# EAGLE design AX12hat (EAGLE 7.4.0)
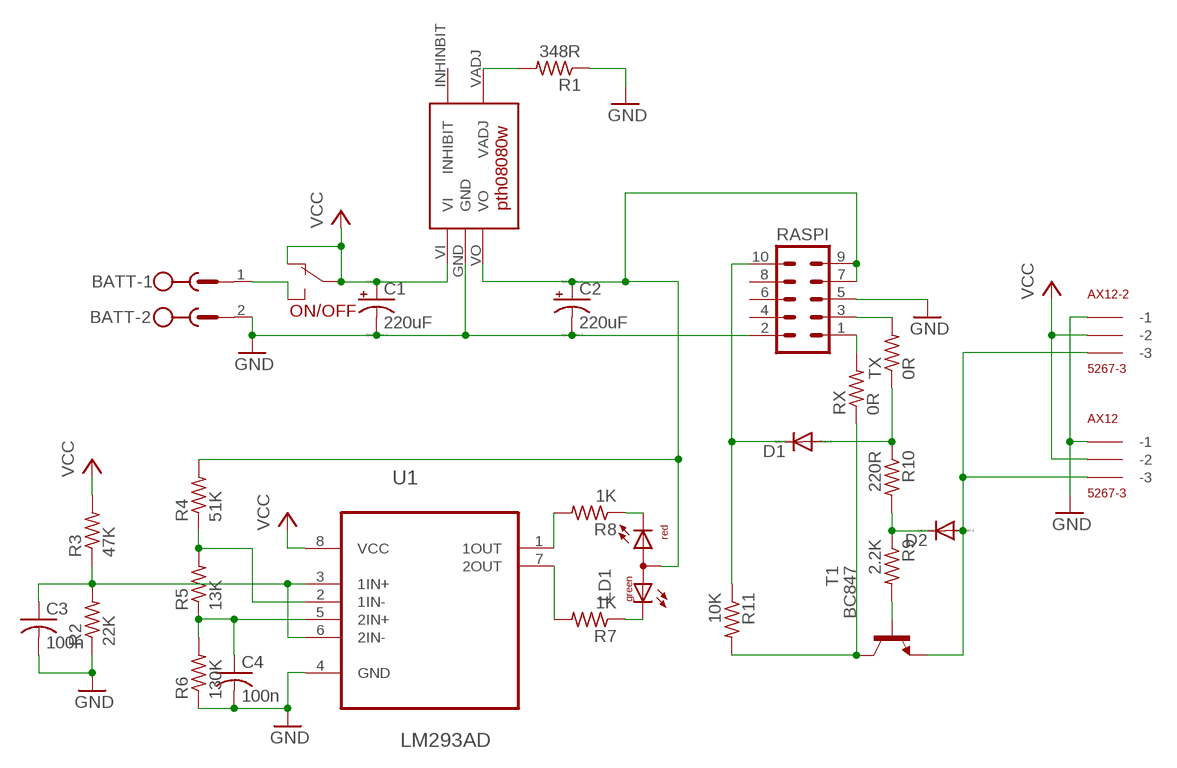
[diagram p0: schematic, sheet 1]

## Parts
AX12  5267-3  [5267-3]
AX12-2  5267-3  [5267-3]
BATT  MSTBV2  [MSTBV2]
C1  220uF  CPOL-USE2.5-7  [E2,5-7]
C2  220uF  CPOL-USE2.5-7  [E2,5-7]
C3  100n  C-USC0805  [C0805]
C4  100n  C-USC0805  [C0805]
D1  DIODE-SOD523  [SOD523]
D2  DIODE-SOD523  [SOD523]
LD1  DUOLED-RG-A  [DUOLED-A-5MM]
ON/OFF  SWITCH  [SWITCH]
R1  348R  R-US_R0805  [R0805]
R2  22K  R-US_R0805  [R0805]
R3  47K  R-US_R0805  [R0805]
R4  51K  R-US_R0805  [R0805]
R5  13K  R-US_R0805  [R0805]
R6  130K  R-US_R0805  [R0805]
R7  1K  R-US_R0805  [R0805]
R8  1K  R-US_R0805  [R0805]
R9  2.2K  R-US_R0805  [R0805]
R10  220R  R-US_R0805  [R0805]
R11  10K  R-US_R0805  [R0805]
RASPI  MA05-2  [MA05-2]
RX  0R  R-US_R0805  [R0805]
T1  BC847  [SOT23]
TX  0R  R-US_R0805  [R0805]
U1  LM293AD  [SOIC127P600X175-8N]
U$1  REGUL_PTH  [REGUL_PTH]

## Nets
GND: AX12-2.P$1(-1) AX12.P$1(-1) BATT.2 C1.- C2.- C3.2 C4.2 R1.1 R2.1 R6.1 RASPI.2 RASPI.5 U1.4(GND) U$1.GND
N$1: C2.+ LD1.A R4.2 RASPI.7 RASPI.9 U$1.VO
N$2: R1.2 U$1.VADJ
N$3: R8.2 U1.1(1OUT)
N$4: LD1.CR R8.1
N$5: R7.2 U1.7(2OUT)
N$6: LD1.CX(CG) R7.1
N$7: D2.C R9.1 R10.2
N$8: AX12-2.P$3(-3) AX12.P$3(-3) D2.A T1.2(E)
N$9: C3.1 R2.2 R3.1 U1.3(1IN+) U1.6(2IN-)
N$10: R4.1 R5.2 U1.2(1IN-)
N$11: C4.1 R5.1 R6.2 U1.5(2IN+)
N$12: R9.2 T1.1(B)
N$13: D1.C R11.1 RASPI.10
N$14: RASPI.1 RX.2
N$15: RASPI.3 TX.2
N$16: D1.A R10.1 TX.1
N$17: R11.2 RX.1 T1.3(C)
N$18: BATT.1 ON/OFF.P$3
VCC: AX12-2.P$2(-2) AX12.P$2(-2) C1.+ ON/OFF.P$1 ON/OFF.P$2 R3.2 U1.8(VCC) U$1.VI
Unconnected: RASPI.4 RASPI.6 RASPI.8 U$1.INHINBIT(INHIBIT)

## Library data of the parts
AX12 AX12-2 = con-molex-spox:5267-3
BATT = con-phoenix-500:MSTBV2: PHOENIX; OC_FARNELL: unknown; OC_NEWARK: unknown
C1 C2 = resistor:CPOL-US: POLARIZED CAPACITOR, American symbol
C3 C4 = resistor:C-US: CAPACITOR, American symbol
D1 D2 = diode:DIODE-: DIODE
LD1 = led:DUOLED-RG-A: DUO LED 2 colors (red/green), 5 mm, round, common Anode www.ligitek.com or other producers.
ON/OFF = switch:SWITCH
R1-R11 RX TX = resistor:R-US_: RESISTOR, American symbol
RASPI = con-lstb:MA05-2: PIN HEADER; OC_FARNELL: unknown; OC_NEWARK: unknown
T1 = transistor:BC847: NPN TRANSISTOR
U1 = LM293ADR:LM293AD: DUAL DIFFERENTIAL COMPARATORS; MPN: LM293AD; OC_FARNELL: 8389225; OC_NEWARK: 38K3696; PACKAGE: SOIC-8; SUPPLIER: TI
U$1 = regul_pth:REGUL_PTH: "adjustable voltage regulator pth08080w"

## Board
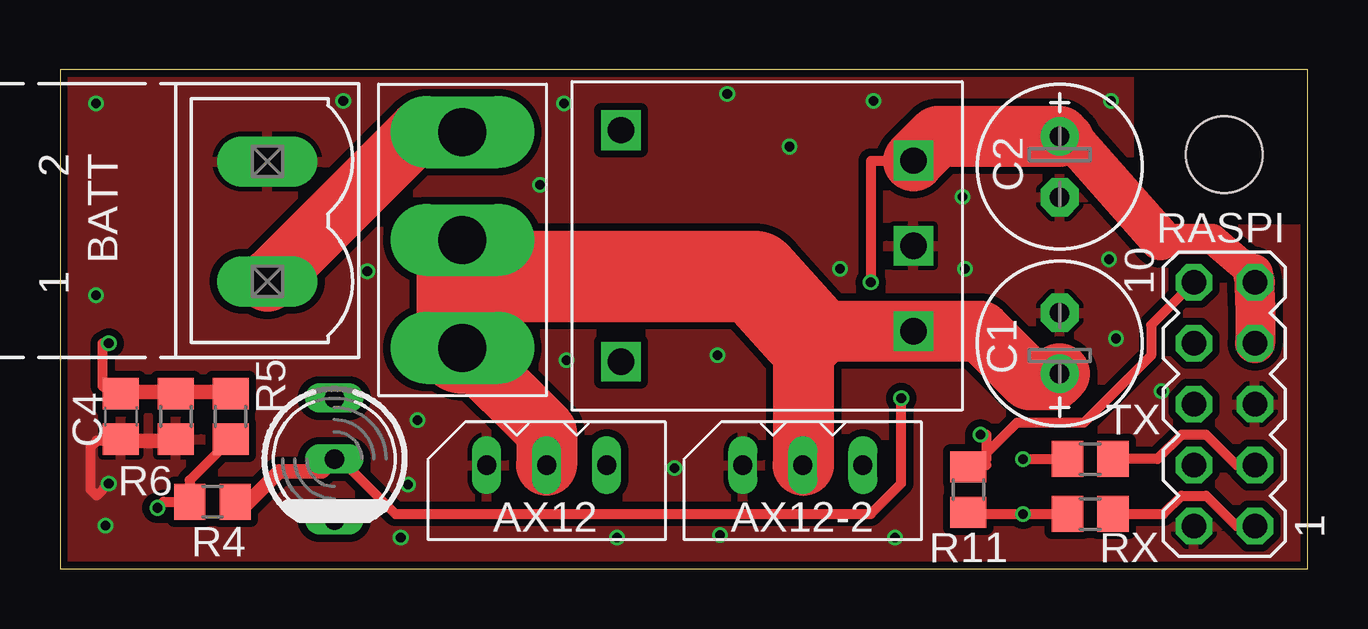
[diagram p1: board, top side]
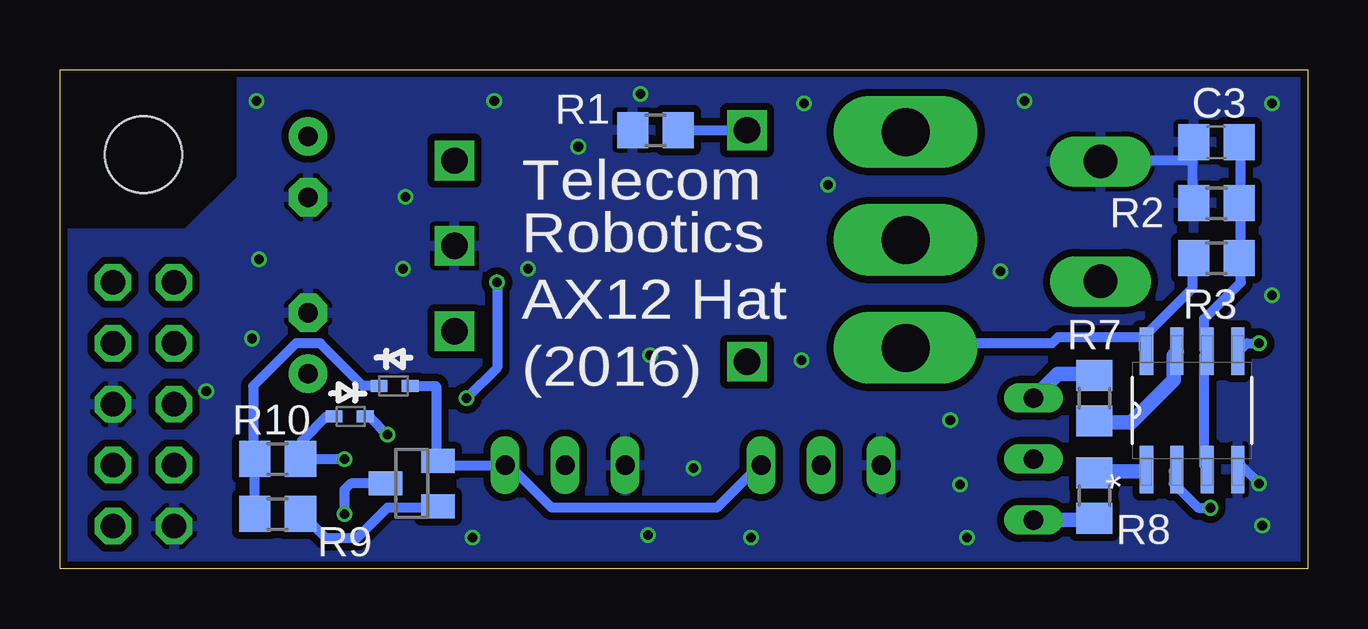
[diagram p2: board, bottom side, seen from below]

Size 51.99 x 20.82 mm. Coordinates in mm from the lower left corner, seen from the top.
Outline: 0,0 51.99,0 51.99,20.82 0,20.82 0,0
Copper layers (1*16): Top 0.018mm / dielectric 1.55mm / Bottom 0.018mm
Design rules "eurocircuit": minimum track width 0.15mm, minimum drill 0.35mm, track to track 0.15mm, track to pad 0.15mm, pad to pad 0.15mm, via to via 0.15mm, smd to smd 0mil, copper to edge 0.25mm, drill to drill 0.35mm, minimum pad ring 0.175mm, minimum via ring 0.125mm, stop-mask expansion 0mil, vias tented up to drill 0.45mm, thermal gap 0.2mm
Holes 3.2 mm at 48.51,17.27

### Footprints (pad centres in the part's own frame; a part is rotated, then mirrored left to right if it is on the bottom)
5267-3 = drill 0.8 long: P$1 0,0; P$2 2.5,0; P$3 5,0
MSTBV2 = drill 1.397 long: 1 -2.5,0; 2 2.5,0
E2,5-7 = drill 0.813 pad 1.6: + -1.27,0 | drill 0.813 pad 1.6 octagon: - 1.27,0
C0805 = smd 1.3 x 1.5: 1 -0.95,0; 2 0.95,0
SOD523 = smd 0.7 x 0.5: A 0.7,0; C -0.6,0
DUOLED-A-5MM = drill 0.813 long: A 0,0; CR 2.54,0; CX -2.54,0
SWITCH = drill 2 long: P$1 4.5,0; P$2 0,0; P$3 -4.5,0
R0805 = smd 1.3 x 1.5: 1 -0.95,0; 2 0.95,0
MA05-2 = drill 1.016 octagon: 1 -5.08,-1.27; 2 -5.08,1.27; 3 -2.54,-1.27; 4 -2.54,1.27; 5 0,-1.27; 6 0,1.27; 7 2.54,-1.27; 8 2.54,1.27; 9 5.08,-1.27; 10 5.08,1.27
SOT23 = smd 1 x 1.4: 1 -0.95,-1.1; 2 0.95,-1.1; 3 0,1.1
SOIC127P600X175-8N = smd 1.981 x 0.559: 1 -2.464,1.905; 2 -2.464,0.635; 3 -2.464,-0.635; 4 -2.464,-1.905; 5 2.464,-1.905; 6 2.464,-0.635; 7 2.464,0.635; 8 2.464,1.905
REGUL_PTH = drill 1.1 square: GND -6.096,1.27; INHINBIT 6.096,6.096; VADJ 6.096,-3.556; VI -6.096,4.826; VO -6.096,-2.286

### Placement (x,y rotation side)
AX12  17.78,4.32 0 top
AX12-2  28.45,4.32 0 top
BATT  8.64,14.48 90 top
C1  41.66,9.4 90 top
C2  41.66,16.76 270 top
C3  3.81,17.78 180 bottom
C4  2.54,6.35 270 top
D1  39.88,6.35 180 bottom
D2  38.1,7.62 0 bottom
LD1  11.43,4.57 270 top
ON/OFF  16.76,13.72 270 top
R1  27.18,18.29 0 bottom
R2  3.81,15.24 0 bottom
R3  3.81,12.95 180 bottom
R4  6.35,2.79 0 top
R5  7.11,6.35 270 top
R6  4.83,6.35 90 top
R7  8.89,7.11 270 bottom
R8  8.89,3.05 90 bottom
R9  42.93,2.29 0 bottom
R10  42.93,4.57 180 bottom
R11  37.85,3.3 270 top
RASPI  48.51,6.86 90 top
RX  42.93,2.29 0 top
T1  37.34,3.56 90 bottom
TX  42.93,4.57 0 top
U1  4.83,6.6 90 bottom
U$1  29.46,14.73 180 top

### Tracks (layer width: path | path; a pad name or v marks a point on that pad's centre or on a via)
GND  (via drill 0.4)
  Top 0.406: C4.2 2.29,5.33 1.52,5.33 1.27,5.08 1.27,3.3 1.52,3.05 v2.03,3.56
  Top 0.61: R6.1 4.83,5.33 2.54,5.33 C4.2
  Bottom 0.406: 4.83,17.02 4.83,17.78 C3.2 | 4.83,17.02 4.83,15.24 R2.1 | 4.83,17.02 8.64,17.02 BATT.2 | v2.03,3.56 2.79,4.32 U1.4
  other vias: 1.9,1.8 1.5,11.4 12.8,12.4 1.5,19.4 11.8,19.5 21,19.4 30.4,17.6 27.8,19.8 33.9,19.5 43.8,19.5 45.9,7.4 44,9.6 43.7,12.9 37.7,12.5 37.6,15.5 27.4,8.9 21.1,8.7 32.5,12.5 20,16 25.6,4.2 27.5,1.4 23.2,1.3 14.2,1.3 14.5,3.5 14.9,6.2 34.8,1.3
  pour Top (isolate 0.305): 0,20.83 44.53,20.83 44.53,16.67 46.66,14.18 51.82,14.17 51.82,0 0,0
  pour Bottom (isolate 0.305): 0,20.83 44.45,20.83 44.45,16.26 46.74,13.97 51.82,13.97 51.82,0 0,0
N$1  (via drill 0.4)
  Top 0.406: v35.05,7.11 35.05,3.56 33.78,2.29 13.97,2.29 11.68,4.57 LD1.A | v33.78,11.94 33.78,17.02 U$1.VO
  Top 0.61: R4.2 7.11,2.79 7.37,2.54 7.62,2.54 9.14,4.06 10.92,4.06 LD1.A
  Top 1.27: 45.85,13.75 48,13.75 49.7,12.3
  Top 1.676: 49.7,12.3 RASPI.9 49.8,11.1 49.8,9.4 RASPI.7
  Top 1.778: 42.1,18 45.85,13.75
  Top 1.93: 42.1,18 C2.+
  Top 2.54: U$1.VO 36.58,18.03 C2.+
  Bottom 0.406: v35.05,7.11 33.78,8.38 v33.78,11.94
N$2
  Bottom 0.406: U$1.VADJ 25.91,18.29 26.16,18.54 26.42,18.29 R1.2
N$3
  Bottom 0.61: R8.2 8.89,4.06 6.86,4.06 U1.1
N$4
  Bottom 0.61: LD1.CR 8.89,2.03 R8.1
N$5
  Bottom 0.61: R7.2 8.89,6.1 7.37,6.1 5.59,7.87 5.59,8.89 U1.7
N$6
  Bottom 0.61: LD1.CX 10.41,8.13 8.89,8.13 R7.1
N$7
  Bottom 0.406: R9.1 R10.2 43.94,4.57 43.94,7.62 42.16,9.4 41.15,9.4 39.37,7.62 D2.C
N$8
  Bottom 0.406: D2.A 36.32,7.62 36.32,4.83 T1.2 36.58,4.32 AX12-2.P$3 33.27,4.32 31.5,2.54 24.64,2.54 22.86,4.32 AX12.P$3
N$9
  Bottom 0.406: U1.3 4.32,4.32 4.32,8.89 U1.6 4.32,9.14 4.32,10.41 2.79,11.94 2.79,12.95 | 2.79,12.95 2.79,15.24 | 2.79,12.95 R3.1 | 2.79,15.24 2.79,17.78 C3.1 | 2.79,15.24 R2.2
N$10  (via drill 0.4)
  Top 0.406: R5.2 5.4,3.69 R4.1 4.32,2.79 v4.06,2.54
  Bottom 0.406: v4.06,2.54 4.57,2.54 5.59,3.56 5.59,4.06 U1.2
N$11  (via drill 0.4)
  Top 0.406: C4.1 2.29,7.37 2.03,7.37 1.78,7.62 1.78,9.4 v2.03,9.4
  Top 0.61: C4.1 2.54,7.37 4.83,7.37 R6.2 5.08,7.37 7.11,7.37 R5.1
  Bottom 0.406: v2.03,9.4 2.54,9.4 2.79,9.14 U1.5
N$12
  Bottom 0.406: R9.2 41.91,2.29 40.89,1.27 39.62,1.27 38.35,2.54 36.83,2.54 T1.1
N$13  (via drill 0.4)
  Top 0.406: 38.35,4.32 38.48,4.45 | 38.48,4.45 38.61,4.57 38.61,5.59 v38.35,5.59 | 38.1,4.32 37.85,4.32 R11.1 | 38.1,4.32 38.35,4.32 | 38.1,4.32 39.88,6.1 42.67,6.1 45.47,8.89 45.47,10.16 RASPI.10 | 38.35,4.32 38.61,4.32 38.48,4.45
  Bottom 0.406: v38.35,5.59 39.12,6.35 D1.C
N$14
  Top 0.406: RASPI.1 49.02,1.78 47.75,3.05 46.74,3.05 45.97,2.29 44.2,2.29 43.94,2.03 43.69,2.29 RX.2
N$15
  Top 0.406: TX.2 45.72,4.57 46.74,5.59 47.75,5.59 49.02,4.32 RASPI.3
N$16  (via drill 0.4)
  Top 0.406: v40.13,4.57 R10.1
  Bottom 0.406: D1.A 40.89,6.35 41.91,5.33 41.91,4.57 R10.1 v40.13,4.57
N$17  (via drill 0.4)
  Top 0.406: RX.1 v40.13,2.29 37.85,2.29 R11.2
  Bottom 0.406: T1.3 39.88,3.56 40.13,3.3 v40.13,2.29
N$18
  Top 2.54: ON/OFF.P$3 16.76,18.29 14.99,18.29 8.89,12.19 BATT.1
VCC
  Top 2.54: ON/OFF.P$2 16.76,12.19 | ON/OFF.P$1 20.28,5.7 AX12.P$2 | AX12-2.P$2 30.99,4.32 30.99,9.91 U$1.VI 38.35,9.91 40.39,7.87 41.4,7.87 C1.+
  Top 3.81: ON/OFF.P$1 16.76,12.19 28.96,12.19 30.99,9.91
  Bottom 0.406: 6.86,9.65 6.86,9.14 U1.8 6.86,9.65 | 6.86,9.65 4.83,11.68 4.83,12.95 R3.2 | 6.86,9.65 10.41,9.65 10.67,9.4 16.76,9.4 ON/OFF.P$1

### Text on the board
bNames: Telecom / Robotics | AX12 Hat | (2016)